# EAGLE design Płytka (EAGLE 9.5.1)
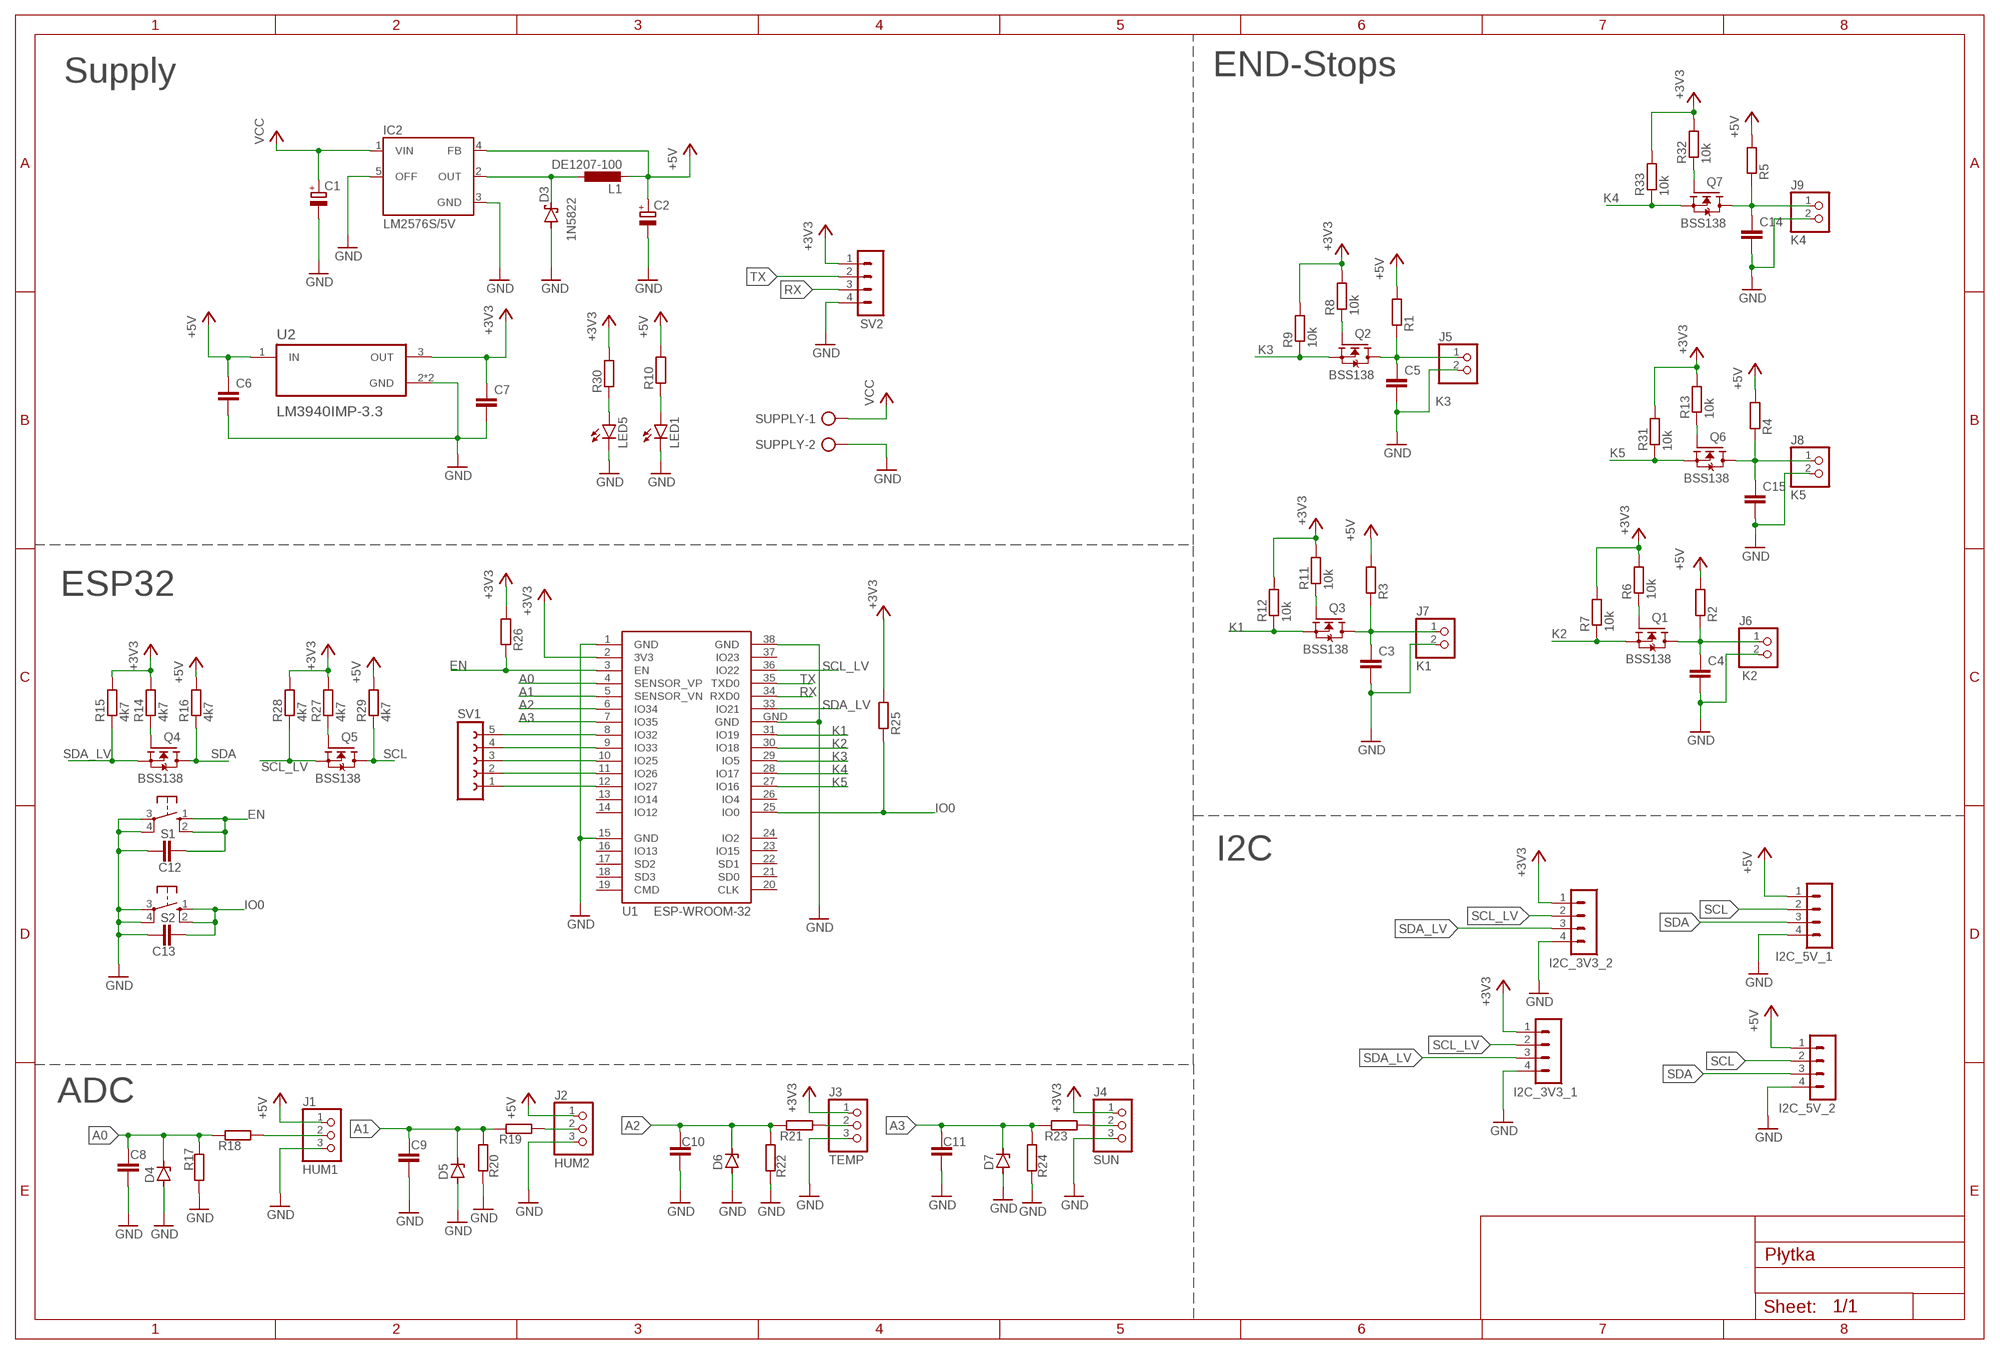
[diagram p0: schematic, sheet 1]

## Parts
C1  CPOL-EUE2.5-6  [E2,5-6]
C2  CPOL-EUE3.5-8  [E3,5-8]
C3  C-EUC0805K  [C0805K]
C4  C-EUC0805K  [C0805K]
C5  C-EUC0805K  [C0805K]
C6  C-EUC0805K  [C0805K]
C7  C-EUC0805K  [C0805K]
C8  C-EUC0805K  [C0805K]
C9  C-EUC0805K  [C0805K]
C10  C-EUC0805K  [C0805K]
C11  C-EUC0805K  [C0805K]
C12  C-EUC0805K  [C0805K]
C13  C-EUC0805K  [C0805K]
C14  C-EUC0805K  [C0805K]
C15  C-EUC0805K  [C0805K]
D3  1N5822  1N5908  [C4111-15]
D4  ZENER-DIODESOD80C  [SOD80C]
D5  ZENER-DIODESOD80C  [SOD80C]
D6  ZENER-DIODESOD80C  [SOD80C]
D7  ZENER-DIODESOD80C  [SOD80C]
I2C_3V3_1  MA04-1  [MA04-1]
I2C_3V3_2  MA04-1  [MA04-1]
I2C_5V_1  MA04-1  [MA04-1]
I2C_5V_2  MA04-1  [MA04-1]
IC2  LM2576S/5V  LM2576T  [TO220-5]
J1  HUM1  WT-2MM-3PINSTRAIGHT  [W_TYPE_2MM_3_N]
J2  HUM2  WT-2MM-3PINSTRAIGHT  [W_TYPE_2MM_3_N]
J3  TEMP  WT-2MM-3PINSTRAIGHT  [W_TYPE_2MM_3_N]
J4  SUN  WT-2MM-3PINSTRAIGHT  [W_TYPE_2MM_3_N]
J5  K3  WT-2MM-2PINSTRAIGHT  [W_TYPE_2MM_2_N]
J6  K2  WT-2MM-2PINSTRAIGHT  [W_TYPE_2MM_2_N]
J7  K1  WT-2MM-2PINSTRAIGHT  [W_TYPE_2MM_2_N]
J8  K5  WT-2MM-2PINSTRAIGHT  [W_TYPE_2MM_2_N]
J9  K4  WT-2MM-2PINSTRAIGHT  [W_TYPE_2MM_2_N]
L1  DE1207-100  [DE1207]
LED1  LEDSML0805  [SML0805]
LED5  LEDSML0805  [SML0805]
Q1  BSS138  [SOT23]
Q2  BSS138  [SOT23]
Q3  BSS138  [SOT23]
Q4  BSS138  [SOT23]
Q5  BSS138  [SOT23]
Q6  BSS138  [SOT23]
Q7  BSS138  [SOT23]
R1  R-EU_R0805  [R0805]
R2  R-EU_R0805  [R0805]
R3  R-EU_R0805  [R0805]
R4  R-EU_R0805  [R0805]
R5  R-EU_R0805  [R0805]
R6  10k  R-EU_R0805  [R0805]
R7  10k  R-EU_R0805  [R0805]
R8  10k  R-EU_R0805  [R0805]
R9  10k  R-EU_R0805  [R0805]
R10  R-EU_R0805  [R0805]
R11  10k  R-EU_R0805  [R0805]
R12  10k  R-EU_R0805  [R0805]
R13  10k  R-EU_R0805  [R0805]
R14  4k7  R-EU_R0805  [R0805]
R15  4k7  R-EU_R0805  [R0805]
R16  4k7  R-EU_R0805  [R0805]
R17  R-EU_R0805  [R0805]
R18  R-EU_R0805  [R0805]
R19  R-EU_R0805  [R0805]
R20  R-EU_R0805  [R0805]
R21  R-EU_R0805  [R0805]
R22  R-EU_R0805  [R0805]
R23  R-EU_R0805  [R0805]
R24  R-EU_R0805  [R0805]
R25  R-EU_R0805  [R0805]
R26  R-EU_R0805  [R0805]
R27  4k7  R-EU_R0805  [R0805]
R28  4k7  R-EU_R0805  [R0805]
R29  4k7  R-EU_R0805  [R0805]
R30  R-EU_R0805  [R0805]
R31  10k  R-EU_R0805  [R0805]
R32  10k  R-EU_R0805  [R0805]
R33  10k  R-EU_R0805  [R0805]
S1  10-XX  [B3F-10XX]
S2  10-XX  [B3F-10XX]
SUPPLY  AK500/2-H  [AK500/2-H]
SV1  FE05-1  [FE05-1]
SV2  MA04-1  [MA04-1]
U1  ESP-WROOM-32  [ESP-WROOM-32]
U2  LM3940IMP-3.3  [SOT230P700X180-4N]

## Nets
+3V3: C7.1 I2C_3V3_1.1 I2C_3V3_2.1 J3.1 J4.1 R6.2 R7.2 R8.2 R9.2 R11.2 R12.2 R13.2 R14.2 R15.2 R25.2 R26.2 R27.2 R28.2 R30.2 R31.2 R32.2 R33.2 SV2.1 U1.2(3V3) U2.3(OUT)
+5V: C2.+ C6.1 I2C_5V_1.1 I2C_5V_2.1 IC2.4(FB) J1.1 J2.1 L1.2 R1.2 R2.2 R3.2 R4.2 R5.2 R10.2 R16.2 R29.2 U2.1(IN)
A0: C8.1 D4.C R17.2 R18.2 U1.4(SENSOR_VP)
A1: C9.1 D5.C R19.2 R20.1 U1.5(SENSOR_VN)
A2: C10.1 D6.C R21.2 R22.1 U1.6(IO34)
A3: C11.1 D7.C R23.2 R24.1 U1.7(IO35)
EN: C12.2 R26.1 S1.1(S) S1.2(S1) U1.3(EN)
GND: C1.- C2.- C3.2 C4.2 C5.2 C6.2 C7.2 C8.2 C9.2 C10.2 C11.2 C12.1 C13.1 C14.2 C15.2 D3.A D4.A D5.A D6.A D7.A I2C_3V3_1.4 I2C_3V3_2.4 I2C_5V_1.4 I2C_5V_2.4 IC2.3(GND) IC2.5(OFF) J1.3 J2.3 J3.3 J4.3 J5.2 J6.2 J7.2 J8.2 J9.2 LED1.C LED5.C R17.1 R20.2 R22.2 R24.2 S1.3(P) S1.4(P1) S2.3(P) S2.4(P1) SUPPLY.2 SV2.4 U1.1(GND) U1.15(GND) U1.38(GND) U1.GND U2.2(GND) U2.4(GND)
IO0: C13.2 R25.1 S2.1(S) S2.2(S1) U1.25(IO0)
K1: Q3.2(S) R12.1 U1.31(IO19)
K2: Q1.2(S) R7.1 U1.30(IO18)
K3: Q2.2(S) R9.1 U1.29(IO5)
K4: Q7.2(S) R33.1 U1.28(IO17)
K5: Q6.2(S) R31.1 U1.27(IO16)
N$1: C5.1 J5.1 Q2.3(D) R1.1
N$2: C4.1 J6.1 Q1.3(D) R2.1
N$3: LED1.A R10.1
N$4: Q4.1(G) R14.1
N$5: C3.1 J7.1 Q3.3(D) R3.1
N$6: C14.1 J9.1 Q7.3(D) R5.1
N$7: C15.1 J8.1 Q6.3(D) R4.1
N$8: Q5.1(G) R27.1
N$9: J1.2 R18.1
N$10: SV1.5 U1.8(IO32)
N$11: Q1.1(G) R6.1
N$12: SV1.4 U1.9(IO33)
N$13: Q2.1(G) R8.1
N$14: SV1.3 U1.10(IO25)
N$15: J4.2 R23.1
N$16: Q3.1(G) R11.1
N$17: SV1.2 U1.11(IO26)
N$18: J2.2 R19.1
N$19: D3.C IC2.2(OUT) L1.1
N$20: Q6.1(G) R13.1
N$21: J3.2 R21.1
N$22: SV1.1 U1.12(IO27)
N$23: LED5.A R30.1
N$24: Q7.1(G) R32.1
RX: SV2.3 U1.34(RXD0)
SCL: I2C_5V_1.2 I2C_5V_2.2 Q5.3(D) R29.1
SCL_LV [U1]: I2C_3V3_1.2 I2C_3V3_2.2 Q5.2(S) R28.1 U1.36(IO22)
SDA: I2C_5V_1.3 I2C_5V_2.3 Q4.3(D) R16.1
SDA_LV [U1]: I2C_3V3_1.3 I2C_3V3_2.3 Q4.2(S) R15.1 U1.33(IO21)
TX: SV2.2 U1.35(TXD0)
VCC: C1.+ IC2.1(VIN) SUPPLY.1
Unconnected: U1.13(IO14) U1.14(IO12) U1.16(IO13) U1.17(SD2) U1.18(SD3) U1.19(CMD) U1.20(CLK) U1.21(SD0) U1.22(SD1) U1.23(IO15) U1.24(IO2) U1.26(IO4) U1.37(IO23)

## Notes on the sheet
- Supply | END-Stops
- ESP32
- I2C
- ADC

## Library data of the parts
C1 C2 = rcl:CPOL-EU: POLARIZED CAPACITOR, European symbol; SPICEPREFIX: C
C3-C15 = rcl:C-EU: CAPACITOR, European symbol; SPICEPREFIX: C
D3 = diode:1N5908: DIODE schottky
D4-D7 = diode:ZENER-DIODE: Z-Diode
I2C_3V3_1 I2C_3V3_2 I2C_5V_1 I2C_5V_2 SV2 = con-lstb:MA04-1: PIN HEADER; OC_FARNELL: unknown; OC_NEWARK: unknown
IC2 = v-reg-3:LM2576: National Semiconductor <http://www.national.com> 3.0A "Simple Switcher"(c) 52kHz, Vout 1.23-37V (HV: 57V), Vin 40V (HV: 60V), 50µA standby current
J1-J4 = PUTRocketLab_connectors:WT-2MM-3PIN
J5-J9 = PUTRocketLab_connectors:WT-2MM-2PIN
L1 = ferrocore:DE1207-100: SMD power coil 100 uH
LED1 LED5 = led:LED: LED OSRAM: - CHIPLED LG R971, LG N971, LY N971, LG Q971, LY Q971, LO R971, LY R971 LH N974, LH R974 LS Q976, LO Q976, LY Q976 LO Q996 - Hyper CHIPLED LW Q18S LB Q993, LB Q99A, LB R99A - SideLED LS A670, LO A670, LY A670, LG A670, LP A670 LB A673, LV A673, LT A673, LW A673 LH A674 LY A675 LS A676, LA A676, LO A676, LY A676, LW A676 LS A679, LY A679, LG A679 - Hyper Micro SIDELED® LS Y876, LA Y876, LO Y876, LY Y876 LT Y87S - SmartLED LW L88C, LW L88S LB L89C, LB L89S, LG L890 LS L89K, LO L89K, LY L89K LS L896, LA L896, LO L896, LY L896 - TOPLED LS T670, LO T670, LY T670, LG T670, LP T670 LSG T670, LSP T670, LSY T670, LOP T670, LYG T670 LG T671, LOG T671, LSG T671 LB T673, LV T673, LT T673, LW T673 LH T674 LS T676, LA T676, LO T676, LY T676, LB T676, LH T676, LSB T676, LW T676 LB T67C, LV T67C, LT T67C, LS T67K, LO T67K, LY T67K, LW E67C LS E67B, LA E67B, LO E67B, LY E67B, LB E67C, LV E67C, LT E67C LW T67C LS T679, LY T679, LG T679 LS T770, LO T770, LY T770, LG T770, LP T770 LB T773, LV T773, LT T773, LW T773 LH T774 LS E675, LA E675, LY E675, LS T675 LS T776, LA T776, LO T776, LY T776, LB T776 LHGB T686 LT T68C, LB T68C - Hyper Mini TOPLED® LB M676 - Mini TOPLED Santana® LG M470 LS M47K, LO M47K, LY M47K Source: http://www.osram.convergy.de LUXEON: - LUMILED® LXK2-PW12-R00, LXK2-PW12-S00, LXK2-PW14-U00, LXK2-PW14-V00 LXK2-PM12-R00, LXK2-PM12-S00, LXK2-PM14-U00 LXK2-PE12-Q00, LXK2-PE12-R00, LXK2-PE12-S00, LXK2-PE14-T00, LXK2-PE14-U00 LXK2-PB12-K00, LXK2-PB12-L00, LXK2-PB12-M00, LXK2-PB14-N00, LXK2-PB14-P00, LXK2-PB14-Q00 LXK2-PR12-L00, LXK2-PR12-M00, LXK2-PR14-Q00, LXK2-PR14-R00 LXK2-PD12-Q00, LXK2-PD12-R00, LXK2-PD12-S00 LXK2-PH12-R00, LXK2-PH12-S00 LXK2-PL12-P00, LXK2-PL12-Q00, LXK2-PL12-R00 Source: www.luxeon.com KINGBRIGHT: KA-3528ASYC Source: www.kingbright.com
Q1-Q7 = bss138_10:BSS138: BSS138 N-Channel Logic Level Enhancement Mode Field Effect Transistor Source: http://www.fairchildsemi.com/datasheets/BS/BSS138.pdf; MF: Fairchild; MPN: BSS138; OC_FARNELL: 9845330; OC_NEWARK: 67R2009
R1-R33 = rcl:R-EU_: RESISTOR, European symbol; SPICEPREFIX: R
S1 S2 = switch-omron:10-XX: OMRON SWITCH; MPN: B3F-1000; OC_FARNELL: 176432; OC_NEWARK: 36M3542
SUPPLY = con-ptr500:AK500/2-H: CONNECTOR Aug. 2004 / PTR Meßtechnik: Die Bezeichnung der Serie AK505 wurde geändert. Es handelt sich hierbei um AK500 in horizontaler Ausführung.; OC_FARNELL: unknown; OC_NEWARK: unknown
SV1 = con-lsta:FE05-1: FEMALE HEADER; OC_FARNELL: unknown; OC_NEWARK: unknown
U1 = esp32:ESP-WROOM-32: Espressif Systems ESP-WROOM-32
U2 = LM3940IMP-3.3:LM3940IMP-3.3: Check prices <https://pricing.snapeda.com/search/part/LM3940IMP-3.3/?ref=eda>; AVAILABILITY: Warning; DESCRIPTION: 1-A, low-dropout voltage regulator for 5-V to 3.3-V conversion 4-SOT-223 -40 to 125; MF: Texas Instruments; MP: LM3940IMP-3.3; PACKAGE: SOT-223-4 Texas Instruments; PRICE: None; PURCHASE-URL: https://pricing.snapeda.com/search/part/LM3940IMP-3.3/?ref=eda

## Net classes
1 U1: width 0.203 mm

## Board
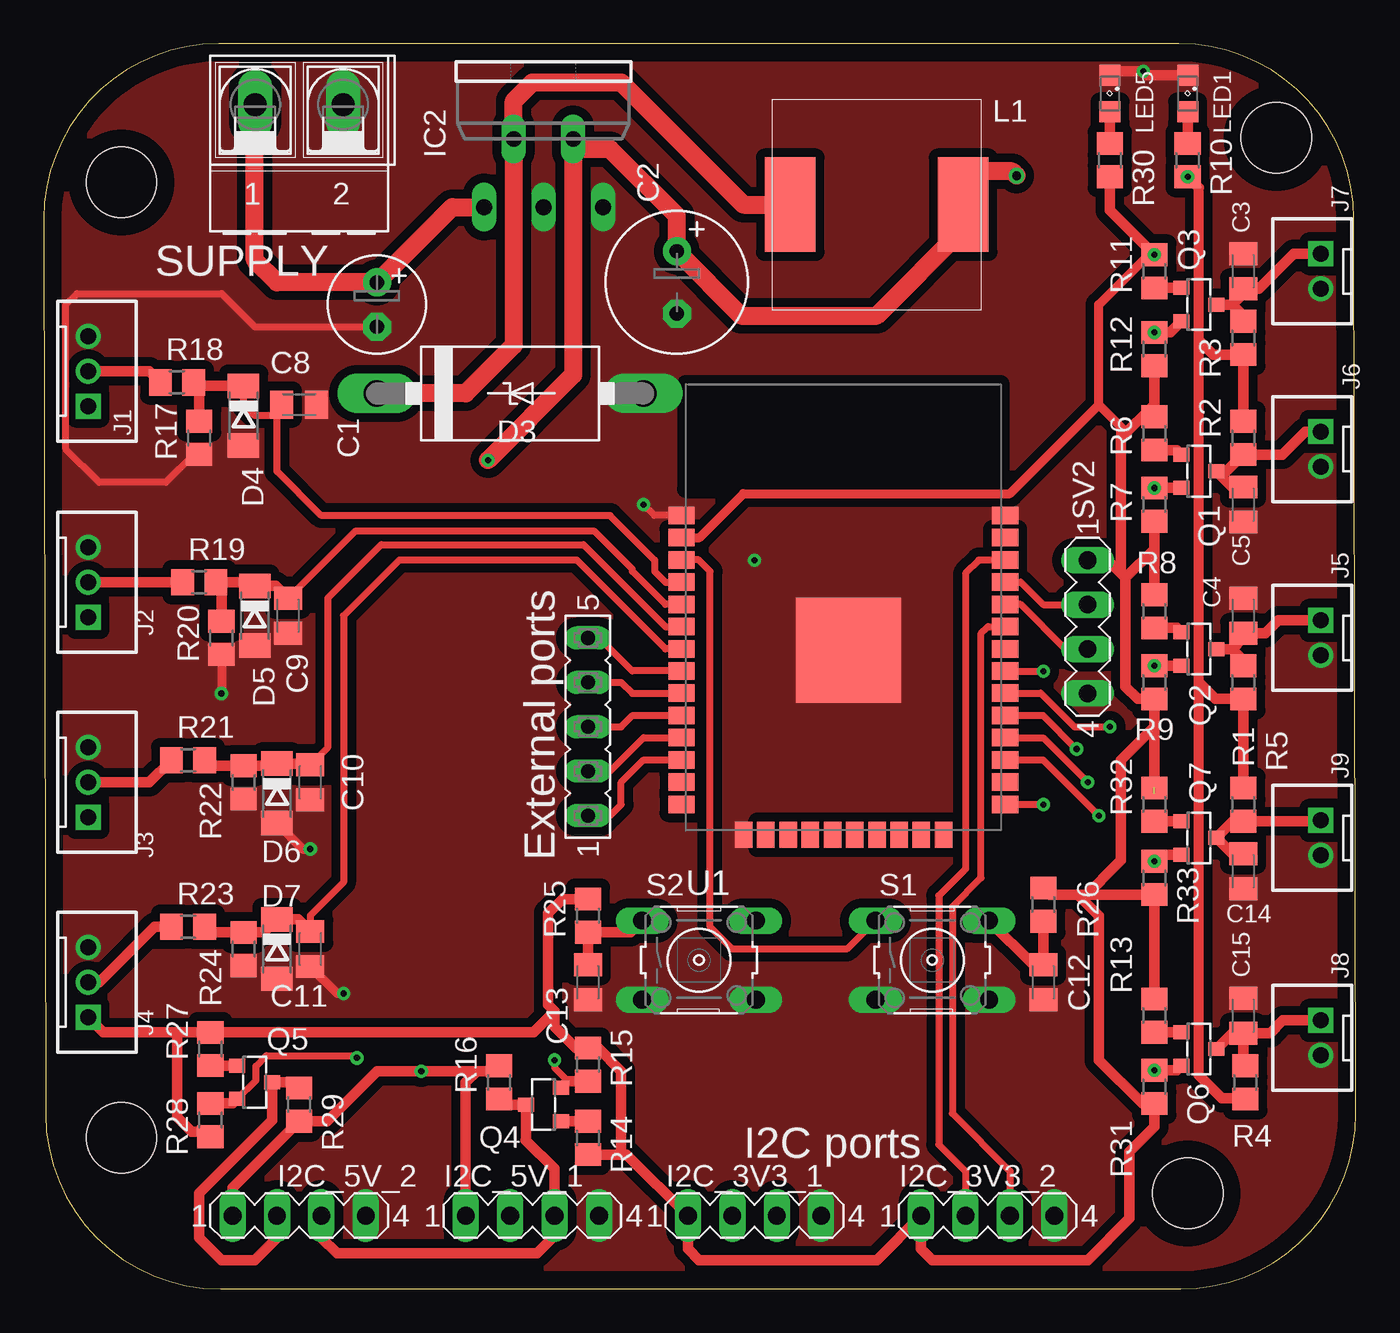
[diagram p1: board, top side]
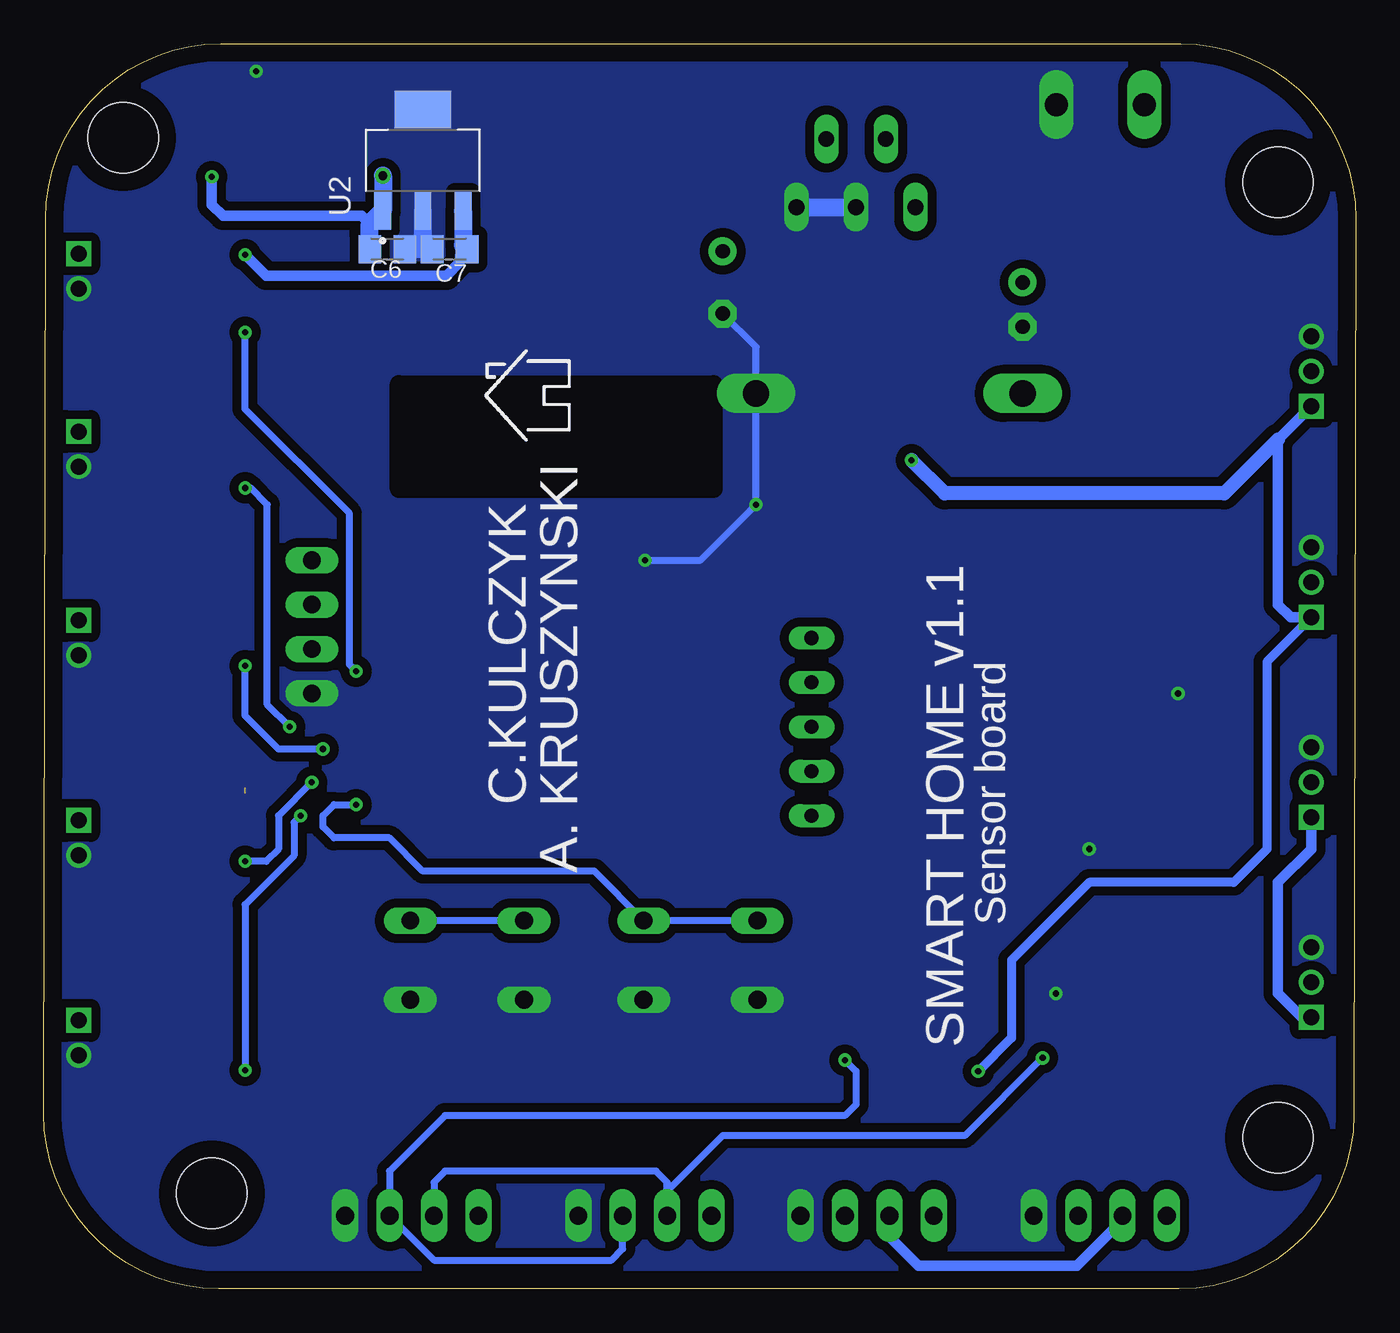
[diagram p2: board, bottom side, seen from below]

Size 75.02 x 71.17 mm. Coordinates in mm from the lower left corner, seen from the top.
Outline: 0,61.17 0.11,9.98 arc90 10.11,0 65.02,0 arc90 75.02,10.02 74.91,61.17 arc90 64.91,71.17 10,71.17 arc90 0,61.17
Copper layers (1*16): Top 0.035mm / dielectric 1.5mm / Bottom 0.035mm
Design rules "default *": minimum track width 6mil, minimum drill 0.35mm, track to track 12mil, track to pad 10mil, pad to pad 6mil, via to via 6mil, smd to smd 6mil, copper to edge 40mil, drill to drill 6mil, minimum pad ring 10mil, minimum via ring 8mil, stop-mask expansion 4mil, vias tented up to drill 0mil, thermal gap 10mil
Holes 4.01 mm at 4.45,63.25 4.45,8.64 65.41,5.46 70.48,65.79

### Footprints (pad centres in the part's own frame; a part is rotated, then mirrored left to right if it is on the bottom)
E2,5-6 = drill 0.813 pad 1.6: + -1.27,0 | drill 0.813 pad 1.6 octagon: - 1.27,0
E3,5-8 = drill 0.813 pad 1.6: + -1.778,0 | drill 0.813 pad 1.6 octagon: - 1.778,0
C0805K = smd 1.3 x 1.6: 1 -1,0; 2 1,0
C4111-15 = drill 1.499 long: A 7.62,0; C -7.62,0
SOD80C = smd 1.4 x 1.8: A 1.7,0; C -1.7,0
MA04-1 = drill 1.016 long: 1 -3.81,0; 2 -1.27,0; 3 1.27,0; 4 3.81,0
TO220-5 = drill 0.9 long: 1 -3.4,-8.4; 2 -1.7,-4.5; 3 0,-8.4; 4 1.7,-4.5; 5 3.4,-8.4
W_TYPE_2MM_3_N = drill 0.914 square: 1 -2,0 | drill 0.914: 2 0,0; 3 2,0
W_TYPE_2MM_2_N = drill 0.914 square: 1 -1,0 | drill 0.914: 2 1,0
DE1207 = smd 2.9 x 5.4: 1 -4.95,0; 2 4.95,0
SML0805 = smd 1.2 x 1.2: A 1.05,0; C -1.05,0
SOT23 = smd 0.8 x 0.9: 1 -0.95,-1; 2 0.95,-1; 3 0,1
R0805 = smd 1.3 x 1.5: 1 -0.95,0; 2 0.95,0
B3F-10XX = drill 1.016 long: 1 -3.251,2.261; 2 3.251,2.261; 3 -3.251,-2.261; 4 3.251,-2.261
AK500/2-H = drill 1.321 long: 1 -2.515,0; 2 2.515,0
FE05-1 = drill 0.813 long: 1 -5.08,0; 2 -2.54,0; 3 0,0; 4 2.54,0; 5 5.08,0
ESP-WROOM-32 = smd 1.5 x 1: 1 -9.25,7; 2 -9.25,5.73; 3 -9.25,4.46; 4 -9.25,3.19; 5 -9.25,1.92; 6 -9.25,0.65; 7 -9.25,-0.62; 8 -9.25,-1.89; 9 -9.25,-3.16; 10 -9.25,-4.43; 11 -9.25,-5.7; 12 -9.25,-6.97; 13 -9.25,-8.24; 14 -9.25,-9.51; 25 9.25,-9.51; 26 9.25,-8.24; 27 9.25,-6.97; 28 9.25,-5.7; 29 9.25,-4.43; 30 9.25,-3.16; 31 9.25,-1.89; 32 9.25,-0.62; 33 9.25,0.65; 34 9.25,1.92; 35 9.25,3.19; 36 9.25,4.46; 37 9.25,5.73; 38 9.25,7 | smd 1 x 1.5: 15 -5.7,-11.25; 16 -4.43,-11.25; 17 -3.16,-11.25; 18 -1.89,-11.25; 19 -0.62,-11.25; 20 0.65,-11.25; 21 1.92,-11.25; 22 3.19,-11.25; 23 4.46,-11.25; 24 5.73,-11.25 | smd 6 x 6: GND 0.3,-0.7
SOT230P700X180-4N = smd 2.15 x 0.95: 1 -2.9,2.3; 2 -2.9,0; 3 -2.9,-2.3 | smd 2.15 x 3.25: 4 2.9,0

### Placement (x,y rotation side)
C1  19.05,56.26 270 top
C2  36.2,57.53 270 top
C3  68.58,58.17 90 top
C4  68.58,44.83 270 top
C5  68.58,38.48 90 top
C6  55.37,59.44 0 bottom
C7  51.82,59.44 180 bottom
C8  14.61,50.55 0 top
C9  13.97,38.48 270 top
C10  15.24,28.96 270 top
C11  15.24,19.43 270 top
C12  57.15,17.53 90 top
C13  31.11,17.53 90 top
C14  68.58,23.88 270 top
C15  68.58,15.62 90 top
D3  26.67,51.18 0 top
D4  11.43,49.91 270 top
D5  12.06,38.48 270 top
D6  13.34,28.32 270 top
D7  13.34,19.43 270 top
I2C_3V3_1  40.64,4.19 0 top
I2C_3V3_2  53.98,4.19 0 top
I2C_5V_1  27.94,4.19 0 top
I2C_5V_2  14.61,4.19 0 top
IC2  28.57,70.23 0 top
J1  2.54,52.45 90 top
J2  2.54,40.39 90 top
J3  2.54,28.96 90 top
J4  2.54,17.53 90 top
J5  73.03,37.21 270 top
J6  73.03,48.01 270 top
J7  73.03,58.17 270 top
J8  73.03,14.35 270 top
J9  73.03,25.78 270 top
L1  47.62,61.98 0 top
LED1  65.41,68.33 270 top
LED5  60.96,68.33 270 top
Q1  66.04,46.74 270 top
Q2  66.04,36.58 270 top
Q3  66.04,56.26 270 top
Q4  28.57,10.54 90 top
Q5  12.06,11.81 270 top
Q6  66.04,13.72 270 top
Q7  66.04,25.78 270 top
R1  68.58,34.67 270 top
R2  68.58,48.64 90 top
R3  68.58,54.36 270 top
R4  68.71,11.81 270 top
R5  68.58,27.69 90 top
R6  63.5,48.9 90 top
R7  63.5,44.83 270 top
R8  63.5,38.73 90 top
R9  63.5,34.67 270 top
R10  65.41,64.52 270 top
R11  63.5,58.17 90 top
R12  63.5,53.72 270 top
R13  63.5,15.62 90 top
R14  31.11,8.64 270 top
R15  31.11,12.83 90 top
R16  26.04,11.81 90 top
R17  8.89,48.64 90 top
R18  7.62,51.82 0 top
R19  8.89,40.39 0 top
R20  10.16,37.21 270 top
R21  8.26,30.23 0 top
R22  11.43,28.96 270 top
R23  8.26,20.7 0 top
R24  11.43,19.43 270 top
R25  31.11,21.34 90 top
R26  57.15,21.97 90 top
R27  9.53,13.72 90 top
R28  9.53,9.65 270 top
R29  14.61,10.54 270 top
R30  60.96,64.52 270 top
R31  63.5,11.56 270 top
R32  63.5,27.69 90 top
R33  63.5,23.5 270 top
S1  50.8,18.8 0 top
S2  37.47,18.8 0 top
SUPPLY  14.61,67.69 0 top
SV1  31.11,32.13 90 top
SV2  59.69,37.85 270 top
U1  45.72,37.21 0 top
U2  53.34,64.52 90 bottom

### Tracks (layer width: path | path; a pad name or v marks a point on that pad's centre or on a via)
+3V3  (via drill 0.35)  (1 unrouted)
  Top 0.508: U1.2 37.48,42.94 40,45.46 55.24,45.46 60.33,50.55 | 60.33,50.55 60.33,56.26 63.18,59.12 v63.5,59.12 | 61.59,48.64 61.59,49.28 60.33,50.55
  Top 0.61: v63.5,59.12 60.96,61.66 R30.2 | R6.2 63.5,50.55 | 63.5,50.55 R12.2 | R7.2 63.5,42.29 | 63.5,42.29 R8.2 | 63.5,32.13 R9.2 62.55,33.72 61.85,34.42 61.85,40.64 | 63.5,32.13 63.5,28.32 | R13.2 R33.2 59.12,22.55 | 59.12,22.55 57.53,22.55 R26.2 | 59.37,22.29 60.33,21.34 60.33,13.08 62.8,10.61 R31.2 63.5,9.27 62.08,7.85 62.08,4.04 59.69,1.65 50.8,1.65 50.16,2.29 I2C_3V3_2.1 47.62,1.65 37.47,1.65 36.83,2.29 I2C_3V3_1.1 33.34,7.69 33.02,7.69 | 59.37,22.29 59.12,22.55 | 59.37,22.29 61.59,24.51 61.59,30.23 63.5,32.13 | 61.85,40.64 61.91,40.7 | 61.91,40.7 63.5,42.29 | SV2.1 60.83,41.66 61.85,40.64 | 61.91,40.7 61.59,41.02 61.59,48.64 63.5,50.55 | R25.2 29.65,22.29 28.83,21.46 28.83,16.26 29.21,15.88 | 29.21,15.88 29.21,14.99 30.42,13.78 R15.2 31.69,13.78 33.02,12.45 33.02,7.69 | 7.62,14.67 R27.2 28,14.67 29.21,15.88 | 7.62,14.67 3.4,14.67 J4.1 | R28.2 9.53,8.83 9.37,8.99 8.46,8.99 7.62,9.82 7.62,14.67 | 33.02,7.69 R14.2
  Bottom 0.61: C7.1 51.2,59.05 51.2,58.7 51.99,57.91 62.3,57.91 v63.5,59.12 | J4.1 3.08,15.53 4.45,16.89 4.45,23.24 2.54,25.15 J3.1
  Bottom 1.016: U2.3 51.04,59.66 C7.1
+5V  (via drill 0.35, 0.5)
  Top 0.559: 66.04,62.93 66.04,54.23 66.04,34.67 66.04,12.2
  Top 0.61: R2.2 R3.2 66.86,53.41 66.04,54.23 | 66.04,62.93 R10.2 | R5.2 R1.2 66.99,33.72 66.04,34.67 | R4.2 68.68,10.89 67.35,10.89 66.04,12.2 | I2C_5V_2.1 10.79,5.78 R29.2 16.2,9.59 19.05,12.45 v21.59,12.45 24.77,12.45 | R16.2 25.72,12.45 24.77,12.45 | I2C_5V_1.1 24.13,11.81 24.77,12.45
  Top 1.016: v25.4,47.37 30.27,52.25 IC2.4 30.86,65.15 32.38,65.15 36.2,61.34 C2.+ 39.88,55.63 47.62,55.63 52.7,60.71 52.7,62.61 52.58,62.48 | 52.58,62.48 L1.2 | 52.58,62.48 52.58,63.12 53.34,63.88 55.37,63.88 v55.63,63.63
  Bottom 0.508: J2.1 5.08,35.85 5.08,25.15 6.99,23.24 15.24,23.24 19.68,18.8 19.68,14.35 v21.59,12.45
  Bottom 0.61: 56.37,60.88 56.83,61.34 64.77,61.34 65.41,61.98 R10.2 | J1.1 4.45,48.55 4.45,39.12 3.71,38.39 J2.1
  Bottom 0.813: 4.45,48.55 7.53,45.47 23.5,45.47 v25.4,47.37
  Bottom 1.016: v55.63,63.63 55.63,61.63 U2.1 56.37,60.88 C6.1
  other vias: 65.41,63.57
A0
  Top 0.406: U1.4 36.45,40.39 35.56,40.39 34.92,41.02 34.92,41.66 32.38,44.2 15.88,44.2 13.34,46.74 13.34,50.28 C8.1 12.97,49.91 12.06,49.91 11.43,50.55 D4.C
  Top 0.61: R17.2 8.89,51.5 R18.2 8.78,51.61 D4.C
A1
  Top 0.406: U1.5 35.55,39.13 33.66,41.02 33.66,41.15 31.5,43.31 17.8,43.31 C9.1
  Top 0.61: R20.1 10.16,40.07 R19.2 11.86,40.39 D5.C 13.27,40.18 C9.1
A2
  Top 0.406: C10.1 16.26,30.97 16.26,39.5 19.3,42.55 30.86,42.55 35.56,37.85 36.45,37.85 U1.6
  Top 0.61: R21.2 9.53,29.91 R22.1 13.22,29.91 D6.C 15.18,30.02 C10.1
A3
  Top 0.406: U1.7 35.55,36.59 30.48,41.66 20.32,41.66 17.14,38.48 17.14,23.24 15.24,21.34 C11.1
  Top 0.61: R23.2 9.53,20.38 R24.1 12.59,20.38 D7.C 14.54,21.13 C11.1
EN
  Top 0.406: S1.1 45.92,19.43 39.37,19.43 38.1,20.7 38.1,41.02 37.45,41.67 U1.3
  Top 0.61: S1.2 56.58,18.53 C12.2 R26.1
  Bottom 0.406: S1.1 S1.2
GND  (via drill 0.35)
  Top 0.406: U1.1 34.91,44.21 v34.29,44.83 | R17.1 8.57,47.69 6.99,46.1 3.17,46.1 1.27,48.01 1.27,56.26 1.91,56.9 10.16,56.9 12.06,54.99 C1.-
  Top 0.508: R20.2 v10.16,34.04 | D6.A 14.81,25.15 v15.24,25.15 | C11.2 16.78,16.89 v17.14,16.89
  Top 0.61: LED5.C 61.18,69.6 v62.87,69.6 63.09,69.38 LED1.C
  Bottom 0.406: v40.64,41.66 37.47,41.66 v34.29,44.83 D3.A 34.29,53.85 C2.-
  Bottom 1.016: U2.2 53.34,59.96 C7.2 C6.2 | IC2.5 IC2.3
  pour Bottom (isolate 0.508, no thermals): -10.16,74.68 -10.16,8.33 arc45 -7.23,1.26 1.27,-7.24 68.88,-7.24 arc45 75.95,-4.31 85.72,5.46 85.72,60.37 arc45 82.8,67.44 76.2,74.04 70.24,80 arc45 63.17,82.93 17.14,82.93 1.6,82.93 arc45 -5.47,80 -10.16,75.31
  pour Top (isolate 0.508, no thermals): 19.68,86.74 13.34,86.74 -8.26,65.15 -8.26,1.02 -5.08,-2.16 5.08,-12.32 57.15,-12.32 71.75,-12.32 90.81,6.73 90.81,68.96 89.53,70.23 73.03,86.74
IO0  (via drill 0.35)
  Top 0.406: v57.15,27.69 54.98,27.69 U1.25
  Top 0.61: S2.1 33.54,20.39 R25.1 C13.2
  Bottom 0.406: S2.1 S2.2 43.54,23.88 53.34,23.88 55.24,25.78 58.42,25.78 59.05,26.42 59.05,27.05 58.42,27.69 v57.15,27.69
K1  (via drill 0.35)
  Top 0.406: U1.31 54.98,35.31 v57.15,35.31
  Top 0.61: Q3.2 64.4,54.67 R12.1
  Bottom 0.406: v57.15,35.31 57.53,35.69 57.53,44.32 63.5,50.29 R12.1
  other vias: 63.5,54.67
K2  (via drill 0.35)
  Top 0.406: U1.30 57.01,34.05 58.93,32.13 v60.96,32.13
  Top 0.61: R7.1 Q1.2
  Bottom 0.406: v60.96,32.13 62.23,33.4 62.23,44.83 63.18,45.78 R7.1
  other vias: 63.5,45.78
K3  (via drill 0.35)
  Top 0.406: U1.29 57.13,32.78 v59.05,30.86 | Q2.2
  Top 0.61: R9.1 Q2.2
  Bottom 0.406: v59.05,30.86 61.59,30.86 63.5,32.77 R9.1
  other vias: 63.5,35.62
K4  (via drill 0.35)
  Top 0.406: U1.28 54.98,31.5 57.15,31.5 v59.69,28.96
  Top 0.61: R33.1 63.89,24.83 Q7.2
  Bottom 0.406: v59.69,28.96 61.59,27.05 61.59,25.15 62.3,24.45 R33.1
  other vias: 63.5,24.45
K5  (via drill 0.35)
  Top 0.406: U1.27 57.13,30.24 v60.33,27.05
  Top 0.61: R31.1 64.78,12.51 Q6.2
  Bottom 0.406: v60.33,27.05 60.71,26.67 60.71,24.77 63.5,21.97 R31.1
  other vias: 63.5,12.51
N$1
  Top 0.406: 68.58,35.94 R1.1 | 68.58,37.21 C5.1
  Top 0.61: Q2.3 67.94,36.58 | 67.94,36.58 68.58,37.21 | 67.94,36.58 68.58,35.94 | C5.1 69.85,37.48 70.58,38.21 J5.1
N$2
  Top 0.61: C4.1 67.94,45.83 Q1.3 67.62,46.74 R2.1 70.81,47.69 72.12,49.01 J6.1
N$3
  Top 0.61: R10.1 LED1.A
N$4
  Top 0.61: Q4.1 R14.1
N$5
  Top 0.61: Q3.3 67.94,56.26 | 67.94,56.26 68.58,56.9 C3.1 69.48,57.17 71.48,59.17 J7.1 | 67.94,56.26 68.58,55.63 R3.1
N$6
  Top 0.61: C14.1 67.94,24.88 Q7.3 68,26.74 R5.1 72.98,26.74 J9.1
N$7
  Top 0.61: R4.1 68.58,12.89 C15.1 | Q6.3 67.94,14.62 C15.1 | C15.1 70.12,14.62 70.85,15.35 J8.1
N$8
  Top 0.61: R27.1 Q5.1
N$9
  Top 0.61: J1.2 6.04,52.45 R18.1
N$10
  Top 0.406: U1.8 33.64,35.32 31.75,37.21 SV1.5
N$11
  Top 0.61: R6.1 64.78,47.95 Q1.1
N$12
  Top 0.406: SV1.4 33.02,34.67 33.66,34.04 36.45,34.04 U1.9
N$13
  Top 0.406: 64.78,37.79 Q2.1
  Top 0.61: R8.1 64.78,37.79
N$14
  Top 0.406: SV1.3 33.02,32.13 33.67,32.78 U1.10
N$15
  Top 0.61: J4.2 3.17,17.53 6.35,20.7 R23.1
N$16
  Top 0.61: R11.1 Q3.1
N$17
  Top 0.406: SV1.2 32.38,29.59 34.3,31.51 U1.11
N$18
  Top 0.61: J2.2 R19.1
N$19
  Top 1.016: D3.C 24.13,51.18 26.88,53.93 IC2.2 26.88,67.9 27.94,68.96 33.02,68.96 40.01,61.98 L1.1
N$20
  Top 0.61: R13.1 Q6.1
N$21
  Top 0.61: J3.2 6.04,28.96 R21.1
N$22
  Top 0.406: SV1.1 32.38,27.05 33.02,27.69 33.02,28.96 34.3,30.24 U1.12
N$23
  Top 0.61: R30.1 LED5.A
N$24
  Top 0.61: R32.1 Q7.1
RX
  Top 0.406: SV2.3 58.42,36.58 55.87,39.13 U1.34
SCL
  Top 0.61: R29.1 14.29,11.81 Q5.3 13.06,9.64 8.89,5.46 8.89,2.92 10.16,1.65 12.06,1.65 13.34,2.92 I2C_5V_2.2
  Bottom 0.61: I2C_5V_2.2 13.34,3.94 15.95,1.32 25.02,1.32 26.67,2.97 I2C_5V_1.2
SCL_LV  (via drill 0.35)
  Top 0.406: U1.36 54.95,41.66 53.47,41.66 52.7,40.89 52.7,24 51.18,22.48 51.18,8.25 52.7,6.73 I2C_3V3_2.2 | Q5.2 12.13,11.93 12.13,12.74 12.73,13.34 17.78,13.34 v17.91,13.21
  Top 0.61: R28.1 10.81,10.6 Q5.2
  Bottom 0.406: I2C_3V3_1.2 39.37,5.59 | 39.37,5.59 39.37,6.1 40.01,6.73 52.07,6.73 52.7,6.1 I2C_3V3_2.2 | v17.91,13.21 22.35,8.76 36.2,8.76 39.37,5.59
SDA
  Top 0.61: R16.1 26.36,10.54 Q4.3 27.57,8.52 27.56,8.51 29.21,6.86 I2C_5V_1.3 29.21,3.05 28.19,2.03 16.76,2.03 15.88,2.92 I2C_5V_2.3
SDA_LV  (via drill 0.35)
  Top 0.406: I2C_3V3_2.3 55.24,6.73 51.94,10.03 51.94,21.84 53.59,23.5 53.59,37.47 53.99,37.86 U1.33 | v29.21,13.08 29.21,12.64 29.97,11.88 R15.1
  Top 0.61: R15.1 29.96,11.88 Q4.2
  Bottom 0.406: I2C_3V3_1.3 41.91,2.29 42.55,1.65 52.7,1.65 I2C_3V3_2.3 55.24,6.73 52.07,9.91 29.21,9.91 28.57,10.54 28.57,12.45 v29.21,13.08
TX
  Top 0.406: U1.35 55.87,40.4 57.15,39.12 SV2.2
VCC
  Top 1.016: IC2.1 23.35,61.83 C1.+ 13.34,57.53 12.06,58.8 12.06,67.67 SUPPLY.1

### Text on the board
tNames: External ports | I2C ports
bNames: A. KRUSZYNSKI | SMART HOME v1.1 | Sensor board | C.KULCZYK